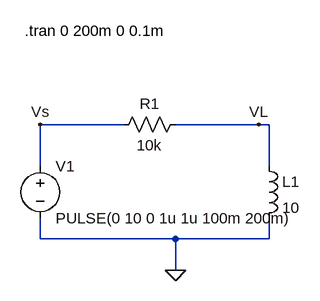
[diagram p0: schematic Cicruit #2.asc]
Cicruit #2.asc, the LTspice schematic file:
Version 4
SHEET 1 880 680
WIRE 240 80 112 80
WIRE 448 80 320 80
WIRE 464 80 448 80
WIRE 112 144 112 80
WIRE 464 144 464 80
WIRE 112 256 112 224
WIRE 320 256 112 256
WIRE 464 256 464 224
WIRE 464 256 320 256
WIRE 320 304 320 256
FLAG 320 304 0
FLAG 112 80 Vs
FLAG 448 80 VL
SYMBOL voltage 112 128 R0
WINDOW 123 0 0 Left 0
WINDOW 39 0 0 Left 0
SYMATTR InstName V1
SYMATTR Value PULSE(0 10 0 1u 1u 100m 200m)
SYMBOL res 336 64 R90
WINDOW 0 0 56 VBottom 2
WINDOW 3 32 56 VTop 2
SYMATTR InstName R1
SYMATTR Value 10k
SYMBOL ind 448 128 R0
SYMATTR InstName L1
SYMATTR Value 10
TEXT 88 -64 Left 2 !.tran 0 200m 0 0.1m

The netlist it stands for:
* Cicruit #2.asc
V1 Vs 0 PULSE(0 10 0 1u 1u 100m 200m)
R1 VL Vs 10k
L1 VL 0 10
.tran 0 200m 0 0.1m
.backanno
.end